# EAGLE schematic switch-amp (EAGLE 6.5.0)
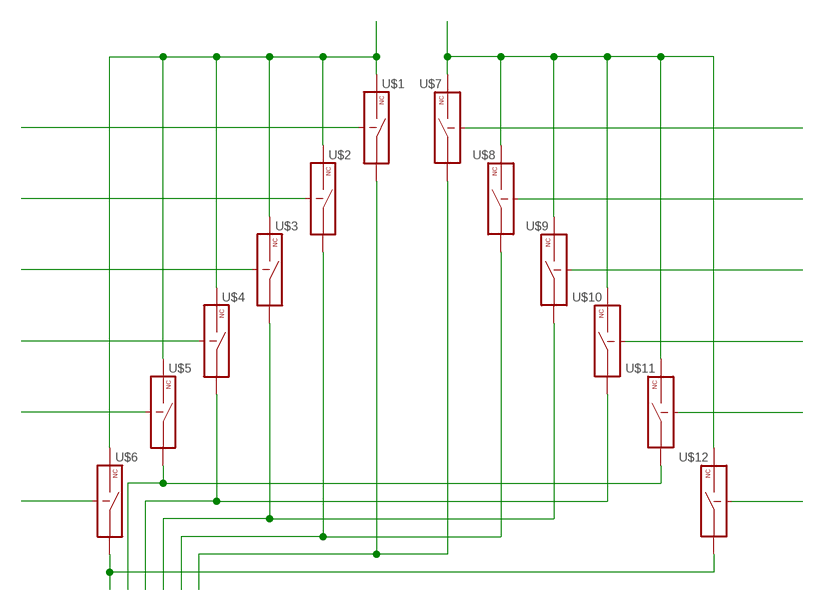
[diagram p0: schematic, sheet 1]

## Parts
U$1  DG467  [TSSOP-6]
U$2  DG467  [TSSOP-6]
U$3  DG467  [TSSOP-6]
U$4  DG467  [TSSOP-6]
U$5  DG467  [TSSOP-6]
U$6  DG467  [TSSOP-6]
U$7  DG467  [TSSOP-6]
U$8  DG467  [TSSOP-6]
U$9  DG467  [TSSOP-6]
U$10  DG467  [TSSOP-6]
U$11  DG467  [TSSOP-6]
U$12  DG467  [TSSOP-6]

## Nets
N$1: U$1.P$1(IN) U$2.P$1(IN) U$3.P$1(IN) U$4.P$1(IN) U$5.P$1(IN) U$6.P$1(IN)
N$2: U$5.P$6(COM) U$11.P$6(COM)
N$4: U$4.P$6(COM) U$10.P$6(COM)
N$5: U$3.P$6(COM) U$9.P$6(COM)
N$6: U$2.P$6(COM) U$8.P$6(COM)
N$7: U$6.P$3(CTL)
N$8: U$5.P$3(CTL)
N$9: U$4.P$3(CTL)
N$10: U$3.P$3(CTL)
N$11: U$2.P$3(CTL)
N$12: U$1.P$3(CTL)
N$14: U$7.P$1(IN) U$8.P$1(IN) U$9.P$1(IN) U$10.P$1(IN) U$11.P$1(IN) U$12.P$1(IN)
N$15: U$12.P$3(CTL)
N$16: U$11.P$3(CTL)
N$17: U$10.P$3(CTL)
N$18: U$9.P$3(CTL)
N$19: U$8.P$3(CTL)
N$20: U$7.P$3(CTL)
N$22: U$6.P$6(COM) U$12.P$6(COM)
N$26: U$1.P$6(COM) U$7.P$6(COM)
Unconnected: U$1.P$2(VEE) U$1.P$4(GND) U$1.P$5(VCC) U$2.P$2(VEE) U$2.P$4(GND) U$2.P$5(VCC) U$3.P$2(VEE) U$3.P$4(GND) U$3.P$5(VCC) U$4.P$2(VEE) U$4.P$4(GND) U$4.P$5(VCC) U$5.P$2(VEE) U$5.P$4(GND) U$5.P$5(VCC) U$6.P$2(VEE) U$6.P$4(GND) U$6.P$5(VCC) U$7.P$2(VEE) U$7.P$4(GND) U$7.P$5(VCC) U$8.P$2(VEE) U$8.P$4(GND) U$8.P$5(VCC) U$9.P$2(VEE) U$9.P$4(GND) U$9.P$5(VCC) U$10.P$2(VEE) U$10.P$4(GND) U$10.P$5(VCC) U$11.P$2(VEE) U$11.P$4(GND) U$11.P$5(VCC) U$12.P$2(VEE) U$12.P$4(GND) U$12.P$5(VCC)

## Library data of the parts
U$1-U$12 = butter:DG467